# EAGLE schematic Cypher - V0.4 (EAGLE 9.0.1)
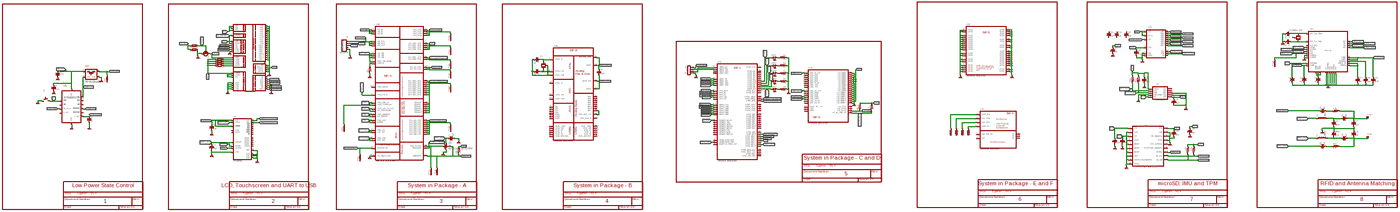
[diagram p0: schematic, sheet 1, overview]
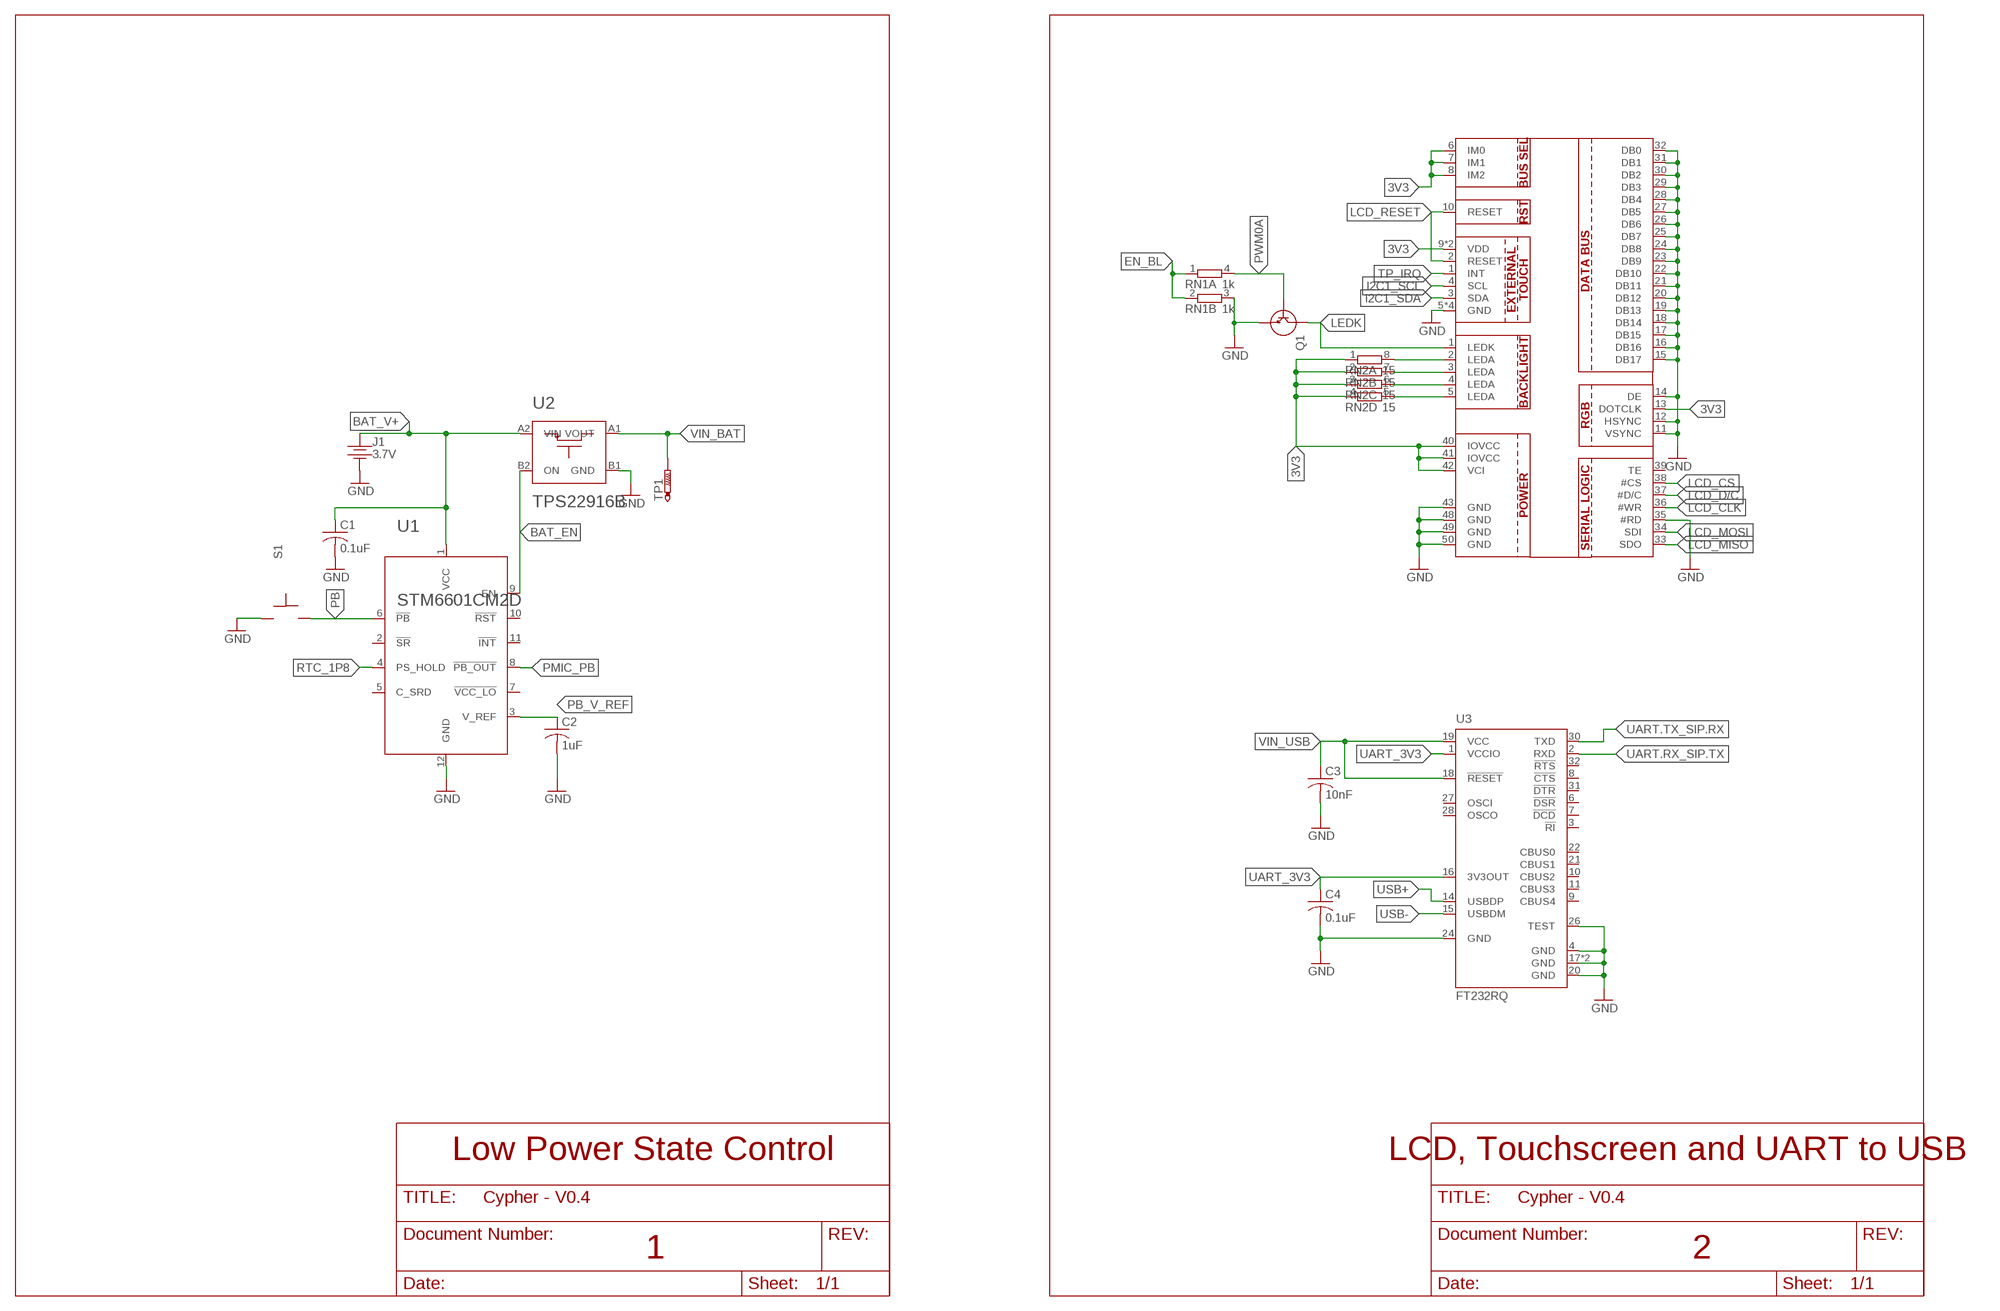
[diagram p1: schematic, sheet 1, part 1 of 5]
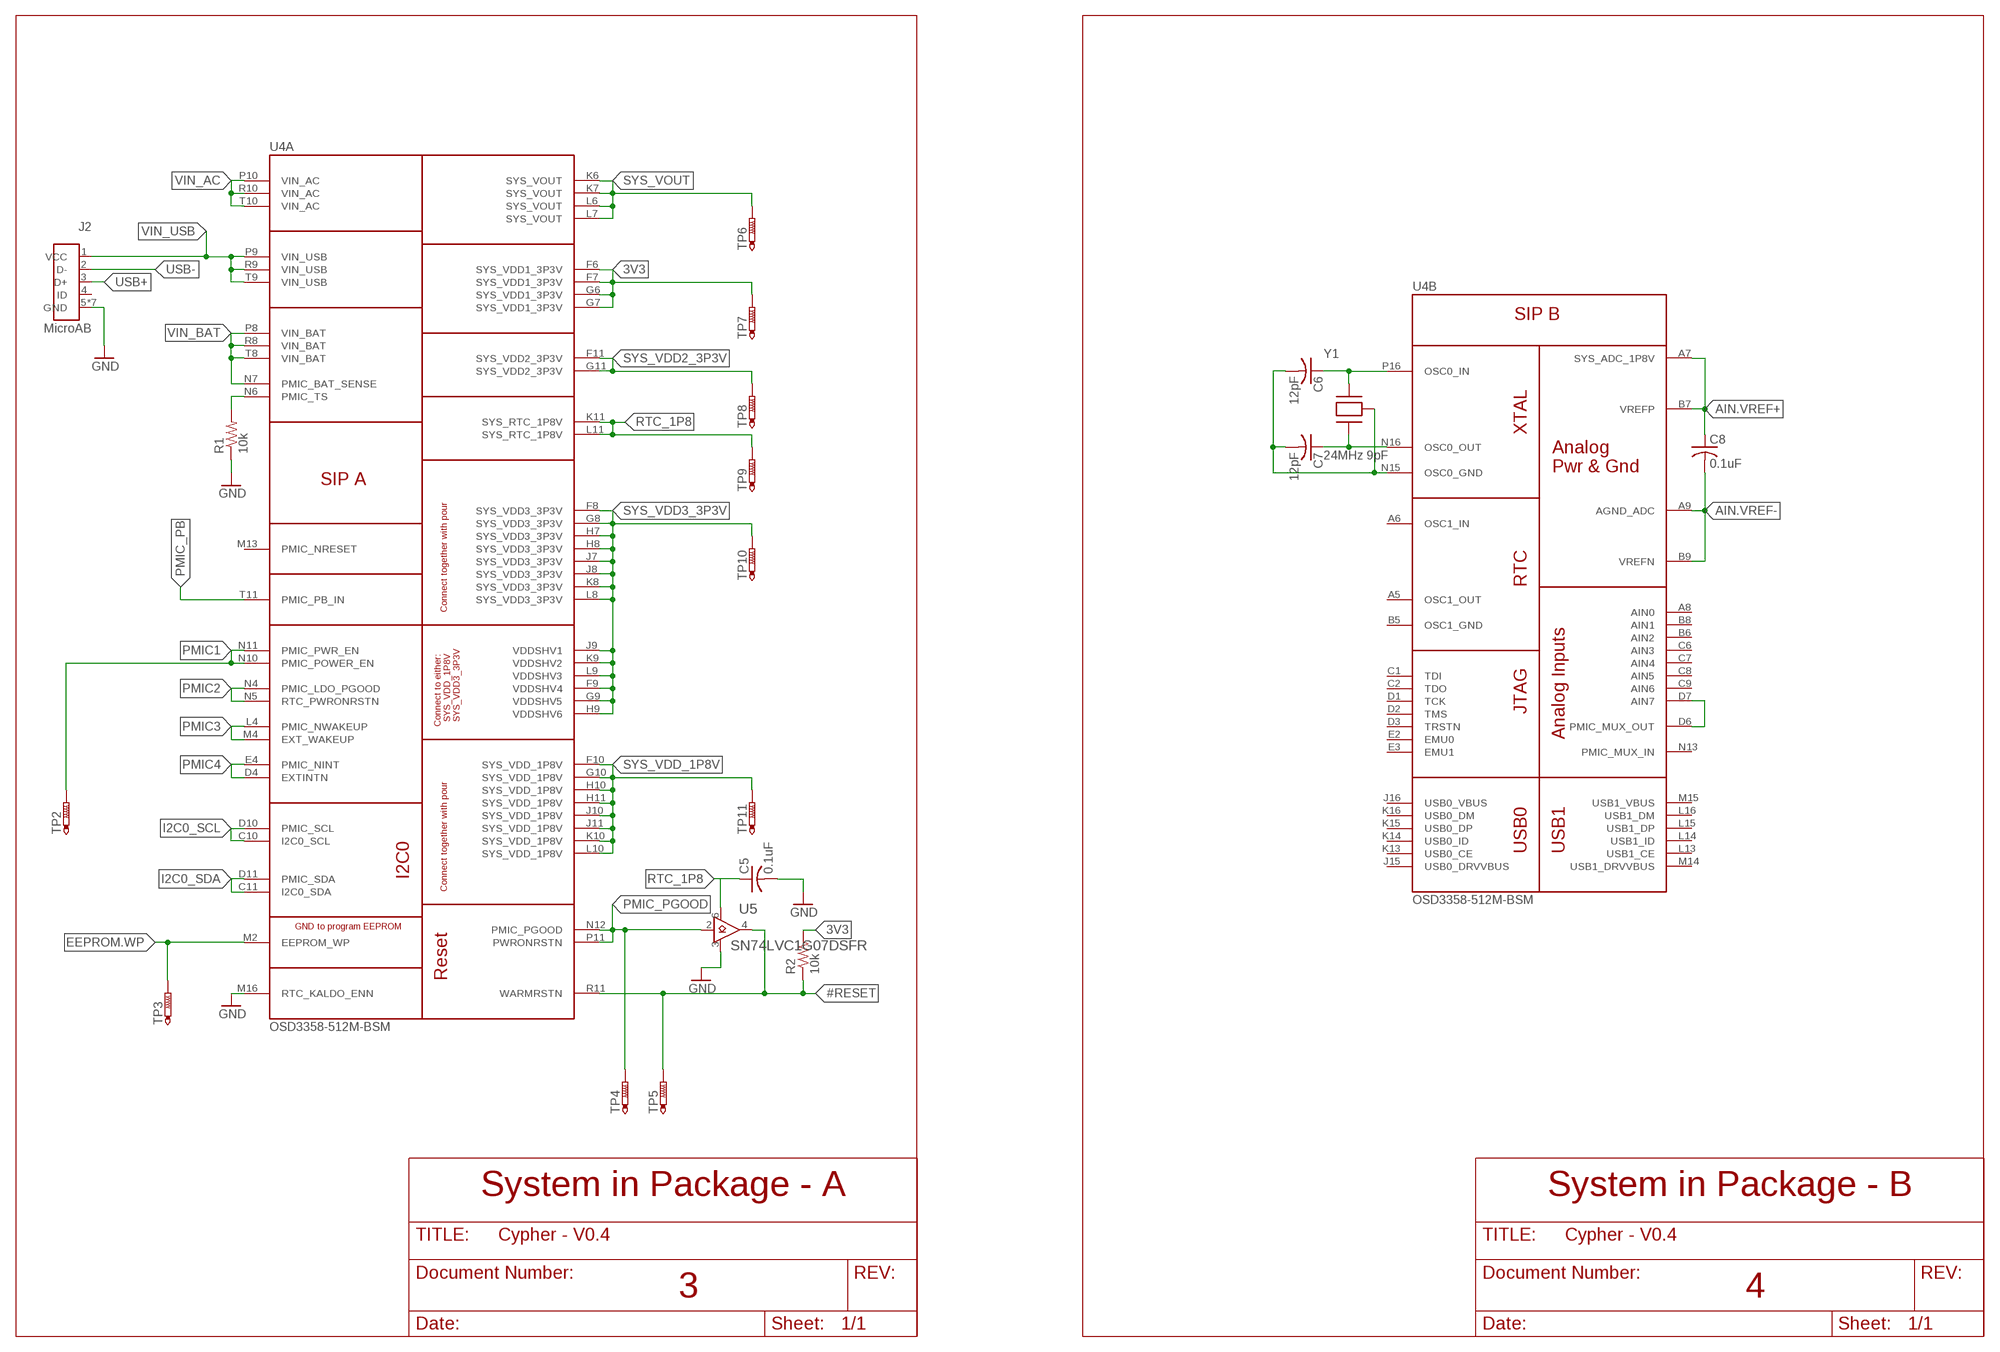
[diagram p2: schematic, sheet 1, part 2 of 5]
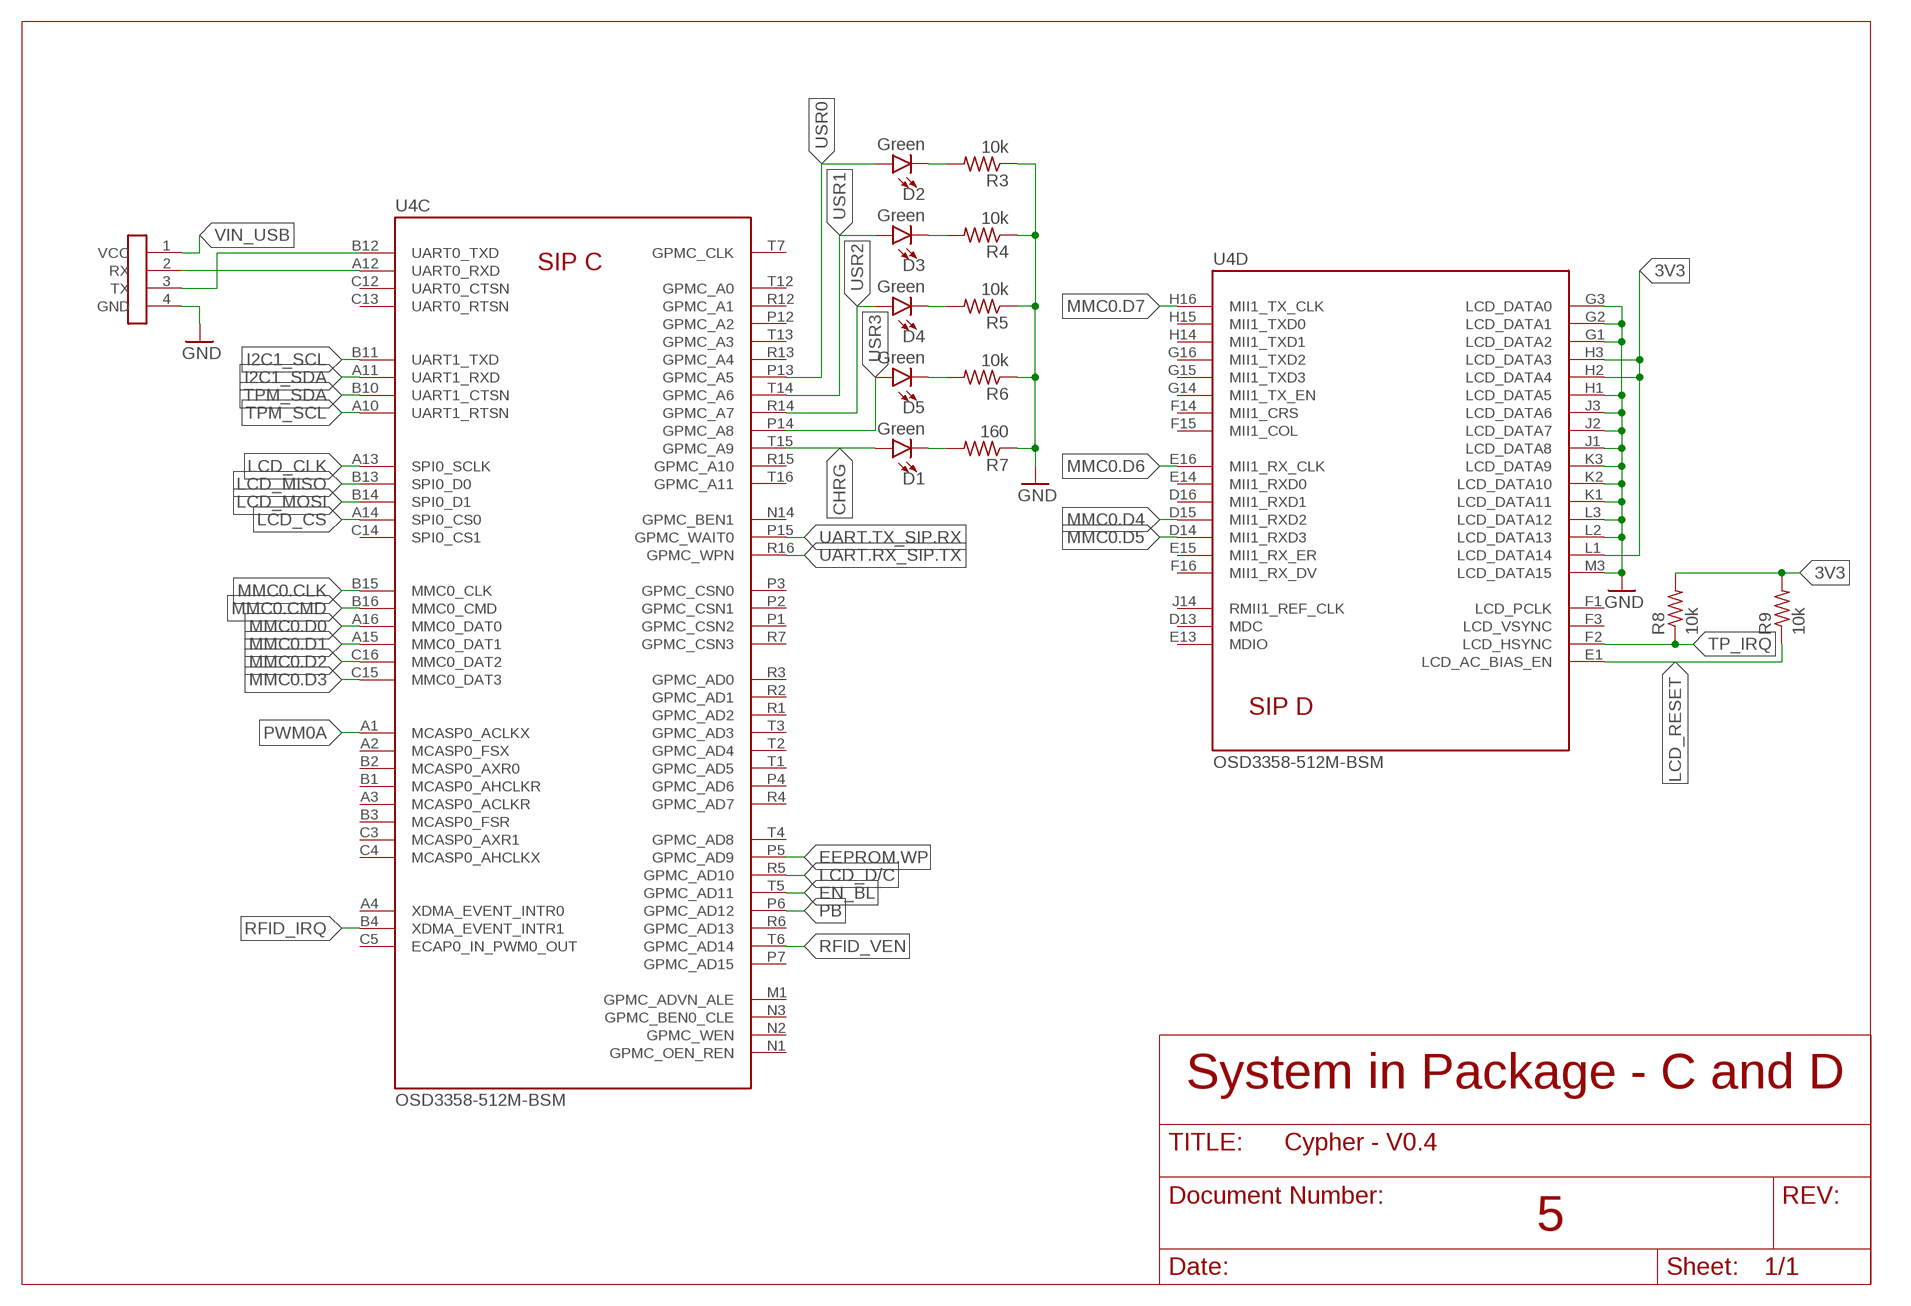
[diagram p3: schematic, sheet 1, part 3 of 5]
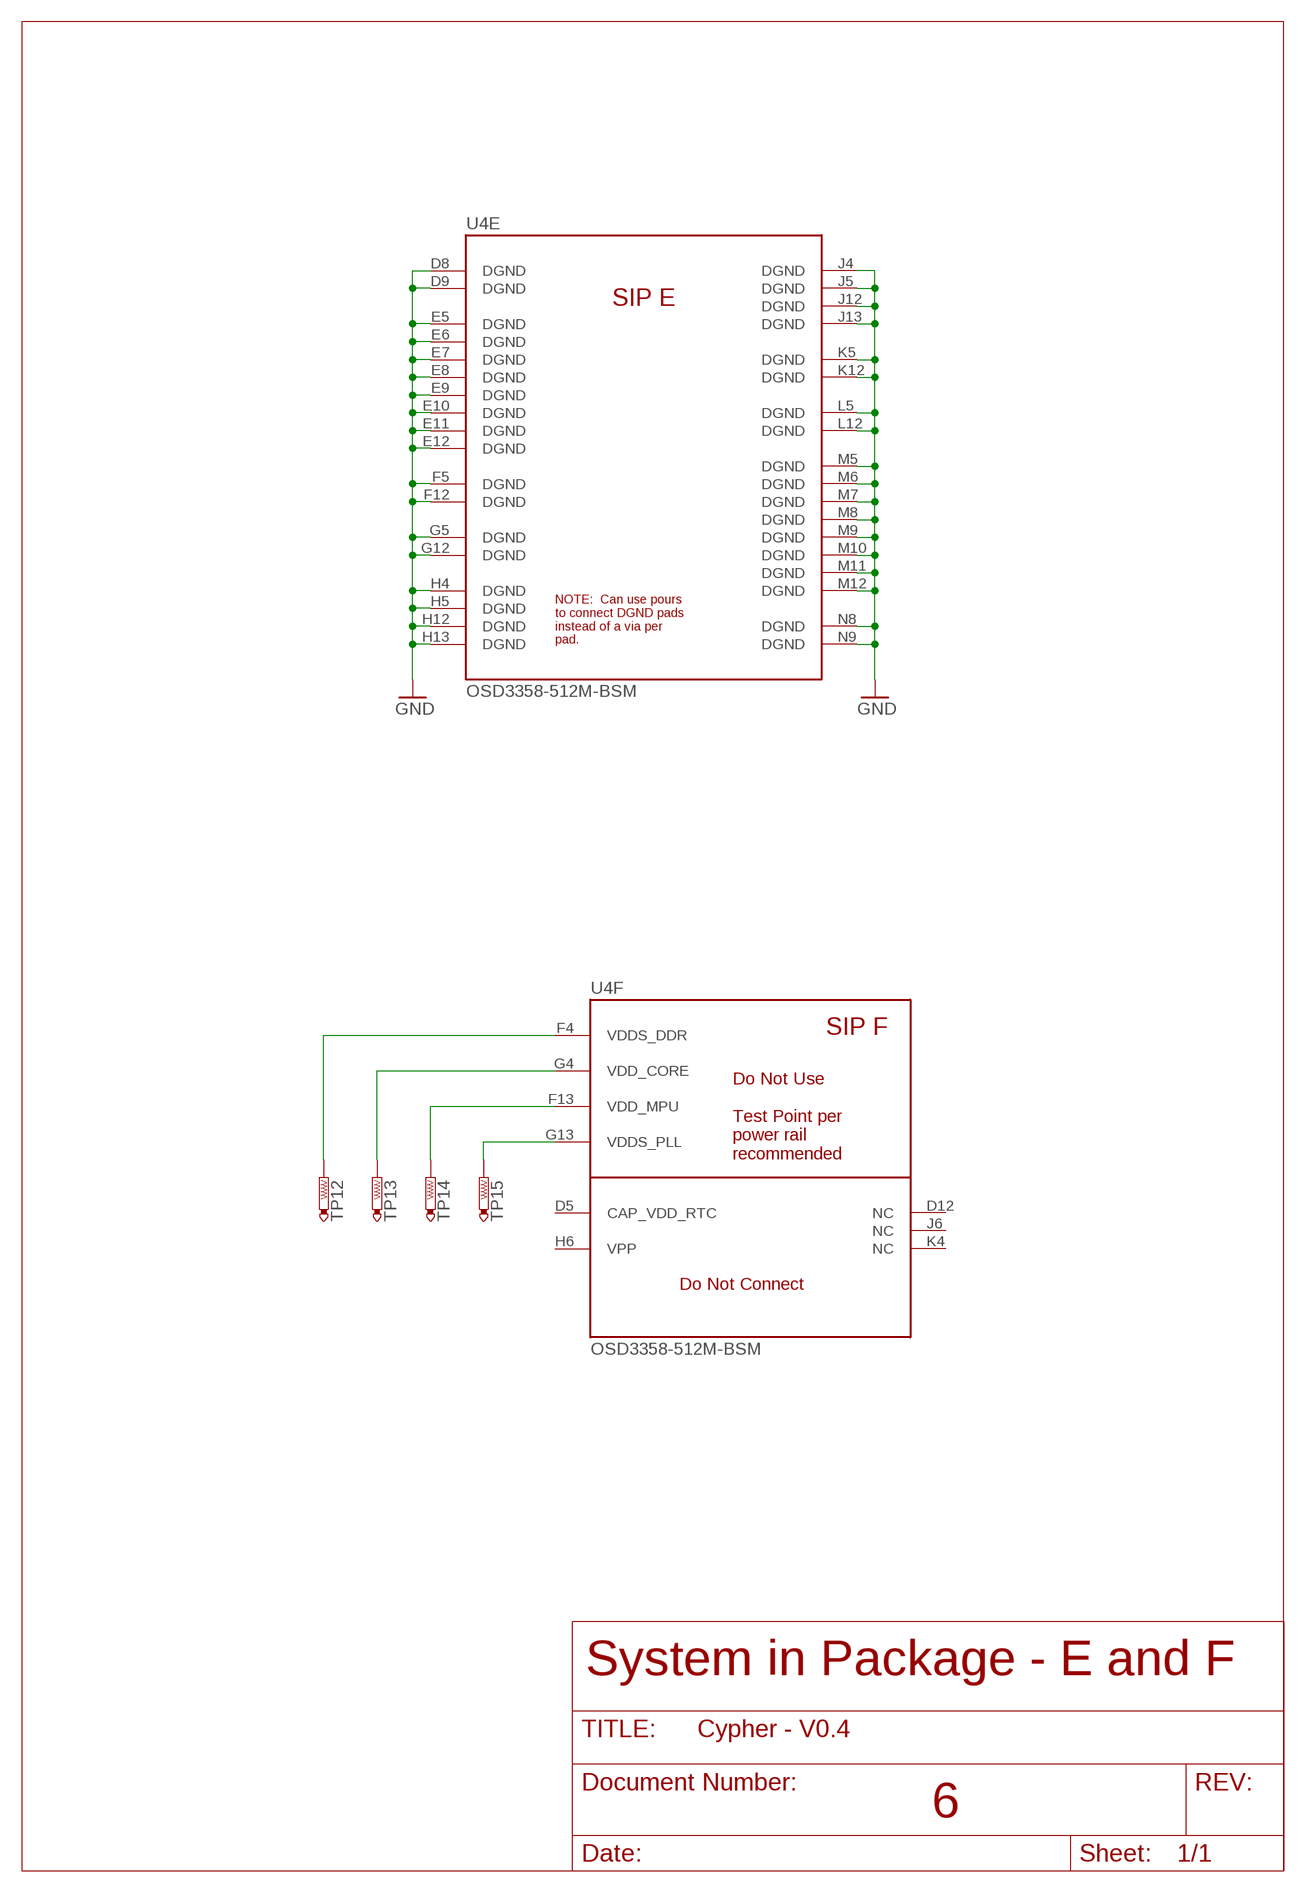
[diagram p4: schematic, sheet 1, part 4 of 5]
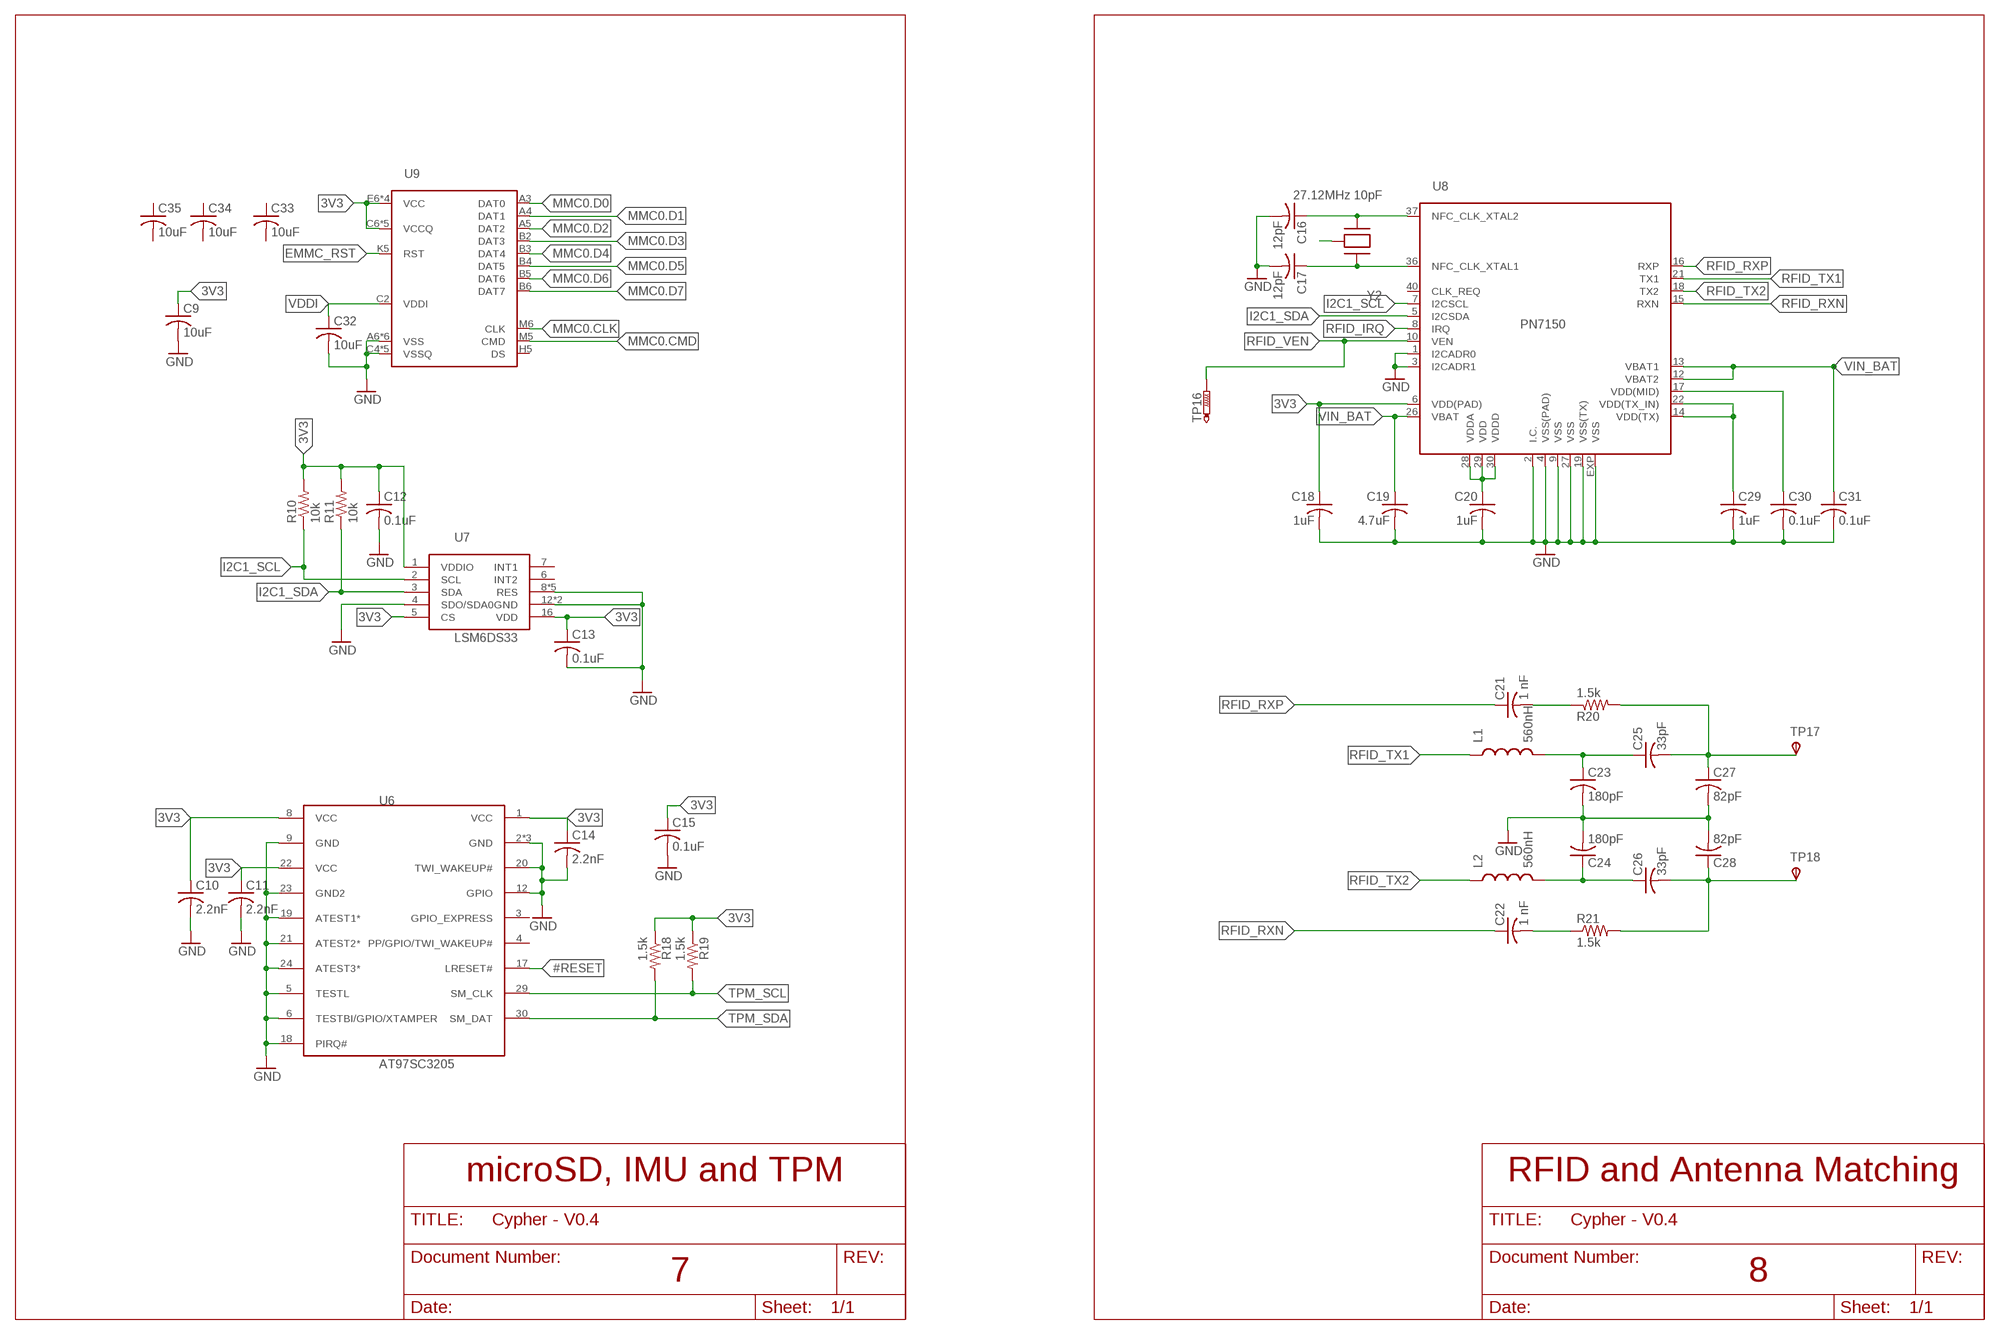
[diagram p5: schematic, sheet 1, part 5 of 5]

## Parts
C1  0.1uF  C-USC0402  [C0402]
C2  1uF  C-USC0402  [C0402]
C3  10nF  C-USC0402  [C0402]
C4  0.1uF  C-USC0402  [C0402]
C5  0.1uF  C-USC0402  [C0402]
C6  12pF  C-USC0402  [C0402]
C7  12pF  C-USC0402  [C0402]
C8  0.1uF  C-USC0402  [C0402]
C9  10uF  C-USC0402  [C0402]
C10  2.2nF  C-USC0402  [C0402]
C11  2.2nF  C-USC0402  [C0402]
C12  0.1uF  C-USC0402  [C0402]
C13  0.1uF  C-USC0402  [C0402]
C14  2.2nF  C-USC0402  [C0402]
C15  0.1uF  C-USC0402  [C0402]
C16  12pF  C-USC0402  [C0402]
C17  12pF  C-USC0402  [C0402]
C18  1uF  C-USC0402  [C0402]
C19  4.7uF  C-USC0402  [C0402]
C20  1uF  C-USC0402  [C0402]
C21  1 nF  C-USC0603  [C0603]
C22  1 nF  C-USC0603  [C0603]
C23  180pF  C-USC0402  [C0402]
C24  180pF  C-USC0402  [C0402]
C25  33pF  C-USC0402  [C0402]
C26  33pF  C-USC0402  [C0402]
C27  82pF  C-USC0402  [C0402]
C28  82pF  C-USC0402  [C0402]
C29  1uF  C-USC0402  [C0402]
C30  0.1uF  C-USC0402  [C0402]
C31  0.1uF  C-USC0402  [C0402]
C32  10uF  C-USC0402  [C0402]
C33  10uF  C-USC0402  [C0402]
C34  10uF  C-USC0402  [C0402]
C35  10uF  C-USC0402  [C0402]
D1  Green  LED0603  [LED-0603]
D2  Green  LED0603  [LED-0603]
D3  Green  LED0603  [LED-0603]
D4  Green  LED0603  [LED-0603]
D5  Green  LED0603  [LED-0603]
J1  3.7V  SH-CONNECTOR  [SH_CONNECTOR]
J2  MicroAB  MICRO_USB_AB_SMD  [MICRO-USB-AB-SMD]
J3  UARTPINSSH  [SM04B-SRSS-TB]
L1  560nH  INDUCTOR0402  [C0402]
L2  560nH  INDUCTOR0402  [C0402]
Q1  MMBT2222ASOT23  [SOT-23-3]
R1  10k  R-US_R0402  [R0402]
R2  10k  R-US_R0402  [R0402]
R3  10k  R-US_R0402  [R0402]
R4  10k  R-US_R0402  [R0402]
R5  10k  R-US_R0402  [R0402]
R6  10k  R-US_R0402  [R0402]
R7  160  R-US_R0402  [R0402]
R8  10k  R-US_R0402  [R0402]
R9  10k  R-US_R0402  [R0402]
R10  10k  R-US_R0402  [R0402]
R11  10k  R-US_R0402  [R0402]
R18  1.5k  R-US_R0402  [R0402]
R19  1.5k  R-US_R0402  [R0402]
R20  1.5k  R-US_R0402  [R0402]
R21  1.5k  R-US_R0402  [R0402]
RN1  1k  2R-NEXBV4V  [EXBV4V]
RN2  15  4R-NEXBN8V  [EXBN8V]
S1  PUSHBUTTON1.2  [EVQ-PUK]
TP1  PTR1B1,27  [B1,27]
TP2  PTR1B1,27  [B1,27]
TP3  PTR1B1,27  [B1,27]
TP4  PTR1B1,27  [B1,27]
TP5  PTR1B1,27  [B1,27]
TP6  PTR1B1,27  [B1,27]
TP7  PTR1B1,27  [B1,27]
TP8  PTR1B1,27  [B1,27]
TP9  PTR1B1,27  [B1,27]
TP10  PTR1B1,27  [B1,27]
TP11  PTR1B1,27  [B1,27]
TP12  PTR1B1,27  [B1,27]
TP13  PTR1B1,27  [B1,27]
TP14  PTR1B1,27  [B1,27]
TP15  PTR1B1,27  [B1,27]
TP16  PTR1B1,27  [B1,27]
TP17  TPSB2,54  [B2,54]
TP18  TPSB2,54  [B2,54]
U1  STM6601CM2D  STM660  [TDFN12]
U2  TPS22916B  [WSON-4PIN]
U3  FT232RQ  [QFN32]
U4  OSD3358-512M-BSM  [OSD335X-BGA-256]
U5  SN74LVC1G07DSFR  [SON35P100X100X40-6N]
U6  AT97SC3205  [QFN32-4MM]
U7  LSM6DS33  [LGA-16]
U8  PN7150  [HVQFN40]
U9  EMMC_EM-20  [153-LFBGA]
XU1  CAPTOUCHSCREEN_6PINFPC10PIN  [DF37NB-10DS-0.4V]
XU2  ILI9388_50PIN_SOCKET  [FPC/FFC_50PIN_0.5MMPITCH]
Y1  24MHz 9pF  TSX-3225  [4-SMD]
Y2  27.12MHz 10pF  CRISTAL_XRCGB  [XRCGB]

## Nets
3V3: C9.1 C10.1 C11.1 C12.1 C13.1 C14.1 C15.1 C18.1 R2.2 R8.2 R9.2 R10.2 R11.2 R18.1 R19.1 RN2.1 RN2.2 RN2.3 RN2.4 TP7.TP U4.F6(A:SYS_VDD1_3P3V) U4.F7(A:SYS_VDD1_3P3V) U4.G6(A:SYS_VDD1_3P3V) U4.G7(A:SYS_VDD1_3P3V) U4.H2(D:LCD_DATA4) U4.H3(D:LCD_DATA3) U4.L1(D:LCD_DATA14) U6.1(VCC) U6.8(VCC) U6.22(VCC) U7.1(VDDIO) U7.5(CS) U7.16(VDD) U8.6(VDD(PAD)) U9.C6(VCCQ) U9.E6(VCC) U9.F5(VCC) U9.J10(VCC) U9.K9(VCC) U9.M4(VCCQ) U9.N4(VCCQ) U9.P3(VCCQ) U9.P5(VCCQ) XU1.9(VDD) XU1.10(VDD) XU2.6(IM0) XU2.7(IM1) XU2.8(IM2) XU2.13(DOTCLK) XU2.40(IOVCC) XU2.41(IOVCC) XU2.42(VCI)
#RESET: R2.1 TP5.TP U4.R11(A:WARMRSTN) U5.4(Y) U6.17(LRESET#)
AIN.VREF+: C8.1 U4.A7(B:SYS_ADC_1P8V) U4.B7(B:VREFP)
AIN.VREF-: C8.2 U4.A9(B:AGND_ADC) U4.B9(B:VREFN)
ANT_1: C25.2 C27.1 R20.2 TP17.TP(PP)
ANT_2: C26.2 C28.1 R21.2 TP18.TP(PP)
BAT_EN: U1.9(EN) U2.B2(ON)
BAT_V+: C1.1 J1.2(V+) U1.1(VCC) U2.A2(VIN)
CHRG: D1.A U4.T15(C:GPMC_A9)
D2_CAT: D2.C R3.2
D2_CAT1: D1.C R7.2
D3_CAT: D3.C R4.2
D4_CAT: D4.C R5.2
D5_CAT: D5.C R6.2
EEPROM.WP: TP3.TP U4.M2(A:EEPROM_WP) U4.P5(C:GPMC_AD9)
EMCF_ANTM1: C23.1 C25.1 L1.2
EMCF_ANTM2: C24.1 C26.1 L2.2
EMMC_RST: U9.K5(RST)
EN_BL: RN1.1 RN1.2 U4.T5(C:GPMC_AD11)
GND: C1.2 C2.2 C3.2 C4.2 C5.2 C9.2 C10.2 C11.2 C12.2 C13.2 C14.2 C15.2 C16.2 C17.2 C18.2 C19.2 C20.2 C23.2 C24.2 C27.2 C28.2 C29.2 C30.2 C31.2 C32.2 J1.1(V-) J2.5(GND) J2.PAD1(GND) J2.PAD2(GND) J2.PAD3(GND) J2.PAD4(GND) J2.PAD5(GND) J2.PAD6(GND) J3.4(GND) Q1.E R1.1 R3.1 R4.1 R5.1 R6.1 R7.1 RN1.3 S1.2 S1.4 U1.12(GND) U2.B1(GND) U3.4(GND) U3.17(GND) U3.20(GND) U3.24(GND) U3.26(TEST) U3.EXP(GND) U4.D8(E:DGND) U4.D9(E:DGND) U4.E5(E:DGND) U4.E6(E:DGND) U4.E7(E:DGND) U4.E8(E:DGND) U4.E9(E:DGND) U4.E10(E:DGND) U4.E11(E:DGND) U4.E12(E:DGND) U4.F5(E:DGND) U4.F12(E:DGND) U4.G1(D:LCD_DATA2) U4.G2(D:LCD_DATA1) U4.G3(D:LCD_DATA0) U4.G5(E:DGND) U4.G12(E:DGND) U4.H1(D:LCD_DATA5) U4.H4(E:DGND) U4.H5(E:DGND) U4.H12(E:DGND) U4.H13(E:DGND) U4.J1(D:LCD_DATA8) U4.J2(D:LCD_DATA7) U4.J3(D:LCD_DATA6) U4.J4(E:DGND) U4.J5(E:DGND) U4.J12(E:DGND) U4.J13(E:DGND) U4.K1(D:LCD_DATA11) U4.K2(D:LCD_DATA10) U4.K3(D:LCD_DATA9) U4.K5(E:DGND) U4.K12(E:DGND) U4.L2(D:LCD_DATA13) U4.L3(D:LCD_DATA12) U4.L5(E:DGND) U4.L12(E:DGND) U4.M3(D:LCD_DATA15) U4.M5(E:DGND) U4.M6(E:DGND) U4.M7(E:DGND) U4.M8(E:DGND) U4.M9(E:DGND) U4.M10(E:DGND) U4.M11(E:DGND) U4.M12(E:DGND) U4.M16(A:RTC_KALDO_ENN) U4.N8(E:DGND) U4.N9(E:DGND) U5.3(GND) U6.2(GND) U6.5(TESTL) U6.6(TESTBI/GPIO/XTAMPER) U6.9(GND) U6.12(GPIO) U6.18(PIRQ#) U6.19(ATEST1*) U6.20(TWI_WAKEUP#) U6.21(ATEST2*) U6.23(GND2) U6.24(ATEST3*) U6.32(GND) U6.EXP(GND) U7.4(SDO/SDA0) U7.8(RES) U7.9(RES) U7.10(RES) U7.11(RES) U7.12(GND) U7.13(GND) U7.15(RES) U8.1(I2CADR0) U8.2(I.C.) U8.3(I2CADR1) U8.4(VSS(PAD)) U8.9(VSS) U8.19(VSS(TX)) U8.27(VSS) U8.EXP(VSS) U9.A6(VSS) U9.C4(VSSQ) U9.E7(VSS) U9.G5(VSS) U9.H10(VSS) U9.J5(VSS) U9.K8(VSS) U9.N2(VSSQ) U9.N5(VSSQ) U9.P4(VSSQ) U9.P6(VSSQ) XU1.5(GND) XU1.6(GND) XU1.7(GND) XU1.8(GND) XU2.11(VSYNC) XU2.12(HSYNC) XU2.14(DE) XU2.15(DB17) XU2.16(DB16) XU2.17(DB15) XU2.18(DB14) XU2.19(DB13) XU2.20(DB12) XU2.21(DB11) XU2.22(DB10) XU2.23(DB9) XU2.24(DB8) XU2.25(DB7) XU2.26(DB6) XU2.27(DB5) XU2.28(DB4) XU2.29(DB3) XU2.30(DB2) XU2.31(DB1) XU2.32(DB0) XU2.35(#RD) XU2.43(GND) XU2.48(GND) XU2.49(GND) XU2.50(GND)
I2C0_SCL: U4.C10(A:I2C0_SCL) U4.D10(A:PMIC_SCL)
I2C0_SDA: U4.C11(A:I2C0_SDA) U4.D11(A:PMIC_SDA)
I2C1_SCL: R10.1 U4.B11(C:UART1_TXD) U7.2(SCL) U8.7(I2CSCL) XU1.4(SCL)
I2C1_SDA: R11.1 U4.A11(C:UART1_RXD) U7.3(SDA) U8.5(I2CSDA) XU1.3(SDA)
LCD_CLK: U4.A13(C:SPI0_SCLK) XU2.36(#WR)
LCD_CS: U4.A14(C:SPI0_CS0) XU2.38(#CS)
LCD_D/C: U4.R5(C:GPMC_AD10) XU2.37(#D/C)
LCD_MISO: U4.B13(C:SPI0_D0) XU2.33(SDO)
LCD_MOSI: U4.B14(C:SPI0_D1) XU2.34(SDI)
LCD_RESET: R9.1 U4.E1(D:LCD_AC_BIAS_EN) XU1.2(RESET) XU2.10(RESET)
LEDA@2: RN2.8 XU2.2(LEDA)
LEDA@3: RN2.7 XU2.3(LEDA)
LEDA@4: RN2.6 XU2.4(LEDA)
LEDA@5: RN2.5 XU2.5(LEDA)
LEDK: Q1.C XU2.1(LEDK)
MMC0.CLK: U4.B15(C:MMC0_CLK) U9.M6(CLK)
MMC0.CMD: U4.B16(C:MMC0_CMD) U9.M5(CMD)
MMC0.D0: U4.A16(C:MMC0_DAT0) U9.A3(DAT0)
MMC0.D1: U4.A15(C:MMC0_DAT1) U9.A4(DAT1)
MMC0.D2: U4.C16(C:MMC0_DAT2) U9.A5(DAT2)
MMC0.D3: U4.C15(C:MMC0_DAT3) U9.B2(DAT3)
MMC0.D4: U4.D15(D:MII1_RXD2) U9.B3(DAT4)
MMC0.D5: U4.D14(D:MII1_RXD3) U9.B4(DAT5)
MMC0.D6: U4.E16(D:MII1_RX_CLK) U9.B5(DAT6)
MMC0.D7: U4.H16(D:MII1_TX_CLK) U9.B6(DAT7)
NC: Y2.2(GND) Y2.4(GND)
OSC_GND: C6.2 C7.2 U4.N15(B:OSC0_GND) Y1.2(GND) Y1.4(GND)
PB: S1.1 S1.3 U1.6(!PB) U4.P6(C:GPMC_AD12)
PB_V_REF: C2.1 U1.3(V_REF)
PMIC1: TP2.TP U4.N10(A:PMIC_POWER_EN) U4.N11(A:PMIC_PWR_EN)
PMIC2: U4.N4(A:PMIC_LDO_PGOOD) U4.N5(A:RTC_PWRONRSTN)
PMIC3: U4.L4(A:PMIC_NWAKEUP) U4.M4(A:EXT_WAKEUP)
PMIC4: U4.D4(A:EXTINTN) U4.E4(A:PMIC_NINT)
PMIC_MUX: U4.D6(B:PMIC_MUX_OUT) U4.D7(B:AIN7)
PMIC_PB: U1.8(!PB_OUT) U4.T11(A:PMIC_PB_IN)
PMIC_PGOOD: TP4.TP U4.N12(A:PMIC_PGOOD) U4.P11(A:PWRONRSTN) U5.2(A)
PMIC_TS: R1.2 U4.N6(A:PMIC_TS)
PWM0A: Q1.B RN1.4 U4.A1(C:MCASP0_ACLKX)
RFID_IRQ: U4.B4(C:XDMA_EVENT_INTR1) U8.8(IRQ)
RFID_MISC_1: C21.2 R20.1
RFID_MISC_2: C22.2 R21.1
RFID_OSC_IN: C17.1 U8.36(NFC_CLK_XTAL1) Y2.1(OSC_IN)
RFID_OSC_OUT: C16.1 U8.37(NFC_CLK_XTAL2) Y2.3(OSC_OUT)
RFID_RXN: C22.1 U8.15(RXN)
RFID_RXP: C21.1 U8.16(RXP)
RFID_TX1: L1.1 U8.21(TX1)
RFID_TX2: L2.1 U8.18(TX2)
RFID_VEN: TP16.TP U4.T6(C:GPMC_AD14) U8.10(VEN)
RTC_1P8: C5.1 TP9.TP U1.4(PS_HOLD) U4.K11(A:SYS_RTC_1P8V) U4.L11(A:SYS_RTC_1P8V) U5.6(VCC)
SIP_OSC_IN: C6.1 U4.P16(B:OSC0_IN) Y1.1(OSC_IN)
SIP_OSC_OUT: C7.1 U4.N16(B:OSC0_OUT) Y1.3(OSC_OUT)
SYS_VDD2_3P3V: TP8.TP U4.F11(A:SYS_VDD2_3P3V) U4.G11(A:SYS_VDD2_3P3V)
SYS_VDD3_3P3V: TP10.TP U4.F8(A:SYS_VDD3_3P3V) U4.F9(A:VDDSHV4) U4.G8(A:SYS_VDD3_3P3V) U4.G9(A:VDDSHV5) U4.H7(A:SYS_VDD3_3P3V) U4.H8(A:SYS_VDD3_3P3V) U4.H9(A:VDDSHV6) U4.J7(A:SYS_VDD3_3P3V) U4.J8(A:SYS_VDD3_3P3V) U4.J9(A:VDDSHV1) U4.K8(A:SYS_VDD3_3P3V) U4.K9(A:VDDSHV2) U4.L8(A:SYS_VDD3_3P3V) U4.L9(A:VDDSHV3)
SYS_VDD_1P8V: TP11.TP U4.F10(A:SYS_VDD_1P8V) U4.G10(A:SYS_VDD_1P8V) U4.H10(A:SYS_VDD_1P8V) U4.H11(A:SYS_VDD_1P8V) U4.J10(A:SYS_VDD_1P8V) U4.J11(A:SYS_VDD_1P8V) U4.K10(A:SYS_VDD_1P8V) U4.L10(A:SYS_VDD_1P8V)
SYS_VOUT: TP6.TP U4.K6(A:SYS_VOUT) U4.K7(A:SYS_VOUT) U4.L6(A:SYS_VOUT) U4.L7(A:SYS_VOUT)
TP_IRQ: R8.1 U4.F2(D:LCD_HSYNC) XU1.1(INT)
TPM_SCL: R19.2 U4.A10(C:UART1_RTSN) U6.29(SM_CLK)
TPM_SDA: R18.2 U4.B10(C:UART1_CTSN) U6.30(SM_DAT)
UART0_RX: J3.2(RX) U4.A12(C:UART0_RXD)
UART0_TX: J3.3(TX) U4.B12(C:UART0_TXD)
UART.RX_SIP.TX: U3.2(RXD) U4.R16(C:GPMC_WPN)
UART.TX_SIP.RX: U3.30(TXD) U4.P15(C:GPMC_WAIT0)
UART_3V3: C4.1 U3.1(VCCIO) U3.16(3V3OUT)
USB+: J2.3(D+) U3.14(USBDP)
USB-: J2.2(D-) U3.15(USBDM)
USR0: D2.A U4.P13(C:GPMC_A5)
USR1: D3.A U4.T14(C:GPMC_A6)
USR2: D4.A U4.R14(C:GPMC_A7)
USR3: D5.A U4.P14(C:GPMC_A8)
VDD: C20.1 U8.28(VDDA) U8.29(VDD) U8.30(VDDD)
VDD(MID): C30.1 U8.17(VDD(MID))
VDD(TX): C29.1 U8.14(VDD(TX)) U8.22(VDD(TX_IN))
VDD_CORE: TP13.TP U4.G4(F:VDD_CORE)
VDD_MPU: TP14.TP U4.F13(F:VDD_MPU)
VDDI: C32.1 U9.C2(VDDI)
VDDS_DDR: TP12.TP U4.F4(F:VDDS_DDR)
VDDS_PLL: TP15.TP U4.G13(F:VDDS_PLL)
VIN_AC: U4.P10(A:VIN_AC) U4.R10(A:VIN_AC) U4.T10(A:VIN_AC)
VIN_BAT: C19.1 C31.1 TP1.TP U2.A1(VOUT) U4.N7(A:PMIC_BAT_SENSE) U4.P8(A:VIN_BAT) U4.R8(A:VIN_BAT) U4.T8(A:VIN_BAT) U8.12(VBAT2) U8.13(VBAT1) U8.26(VBAT)
VIN_USB: C3.1 J2.1(VCC) J3.1(VCC) U3.18(!RESET) U3.19(VCC) U4.P9(A:VIN_USB) U4.R9(A:VIN_USB) U4.T9(A:VIN_USB)
Unconnected: C33.1 C33.2 C34.1 C34.2 C35.1 C35.2 J2.4(ID) U1.2(!SR) U1.5(C_SRD) U1.7(!VCC_LO) U1.10(!RST) U1.11(!INT) U3.3(!RI) U3.6(!DSR) U3.7(!DCD) U3.8(!CTS) U3.9(CBUS4) U3.10(CBUS2) U3.11(CBUS3) U3.21(CBUS1) U3.22(CBUS0) U3.27(OSCI) U3.28(OSCO) U3.31(!DTR) U3.32(!RTS) U4.A2(C:MCASP0_FSX) U4.A3(C:MCASP0_ACLKR) U4.A4(C:XDMA_EVENT_INTR0) U4.A5(B:OSC1_OUT) U4.A6(B:OSC1_IN) U4.A8(B:AIN0) U4.B1(C:MCASP0_AHCLKR) U4.B2(C:MCASP0_AXR0) U4.B3(C:MCASP0_FSR) U4.B5(B:OSC1_GND) U4.B6(B:AIN2) U4.B8(B:AIN1) U4.C1(B:TDI) U4.C2(B:TDO) U4.C3(C:MCASP0_AXR1) U4.C4(C:MCASP0_AHCLKX) U4.C5(C:ECAP0_IN_PWM0_OUT) U4.C6(B:AIN3) U4.C7(B:AIN4) U4.C8(B:AIN5) U4.C9(B:AIN6) U4.C12(C:UART0_CTSN) U4.C13(C:UART0_RTSN) U4.C14(C:SPI0_CS1) U4.D1(B:TCK) U4.D2(B:TMS) U4.D3(B:TRSTN) U4.D5(F:CAP_VDD_RTC) U4.D12(F:NC) U4.D13(D:MDC) U4.D16(D:MII1_RXD1) U4.E2(B:EMU0) U4.E3(B:EMU1) U4.E13(D:MDIO) U4.E14(D:MII1_RXD0) U4.E15(D:MII1_RX_ER) U4.F1(D:LCD_PCLK) U4.F3(D:LCD_VSYNC) U4.F14(D:MII1_CRS) U4.F15(D:MII1_COL) U4.F16(D:MII1_RX_DV) U4.G14(D:MII1_TX_EN) U4.G15(D:MII1_TXD3) U4.G16(D:MII1_TXD2) U4.H6(F:VPP) U4.H14(D:MII1_TXD1) U4.H15(D:MII1_TXD0) U4.J6(F:NC) U4.J14(D:RMII1_REF_CLK) U4.J15(B:USB0_DRVVBUS) U4.J16(B:USB0_VBUS) U4.K4(F:NC) U4.K13(B:USB0_CE) U4.K14(B:USB0_ID) U4.K15(B:USB0_DP) U4.K16(B:USB0_DM) U4.L13(B:USB1_CE) U4.L14(B:USB1_ID) U4.L15(B:USB1_DP) U4.L16(B:USB1_DM) U4.M1(C:GPMC_ADVN_ALE) U4.M13(A:PMIC_NRESET) U4.M14(B:USB1_DRVVBUS) U4.M15(B:USB1_VBUS) U4.N1(C:GPMC_OEN_REN) U4.N2(C:GPMC_WEN) U4.N3(C:GPMC_BEN0_CLE) U4.N13(B:PMIC_MUX_IN) U4.N14(C:GPMC_BEN1) U4.P1(C:GPMC_CSN2) U4.P2(C:GPMC_CSN1) U4.P3(C:GPMC_CSN0) U4.P4(C:GPMC_AD6) U4.P7(C:GPMC_AD15) U4.P12(C:GPMC_A2) U4.R1(C:GPMC_AD2) U4.R2(C:GPMC_AD1) U4.R3(C:GPMC_AD0) U4.R4(C:GPMC_AD7) U4.R6(C:GPMC_AD13) U4.R7(C:GPMC_CSN3) U4.R12(C:GPMC_A1) U4.R13(C:GPMC_A4) U4.R15(C:GPMC_A10) U4.T1(C:GPMC_AD5) U4.T2(C:GPMC_AD4) U4.T3(C:GPMC_AD3) U4.T4(C:GPMC_AD8) U4.T7(C:GPMC_CLK) U4.T12(C:GPMC_A0) U4.T13(C:GPMC_A3) U4.T16(C:GPMC_A11) U5.1(N.C_2) U5.5(N.C) U6.3(GPIO_EXPRESS) U6.4(PP/GPIO/TWI_WAKEUP#) U7.6(INT2) U7.7(INT1) U8.40(CLK_REQ) U9.H5(DS) XU2.39(TE)

## Notes on the sheet
- System in Package - C and D
- 5
- System in Package - E and F | microSD, IMU and TPM | RFID and Antenna Matching
- Low Power State Control | LCD, Touchscreen and UART to USB | System in Package - A | System in Package - B
- 6 | 7 | 8
- 1 | 2 | 3 | 4

## Library data of the parts
C1-C35 = resistor:C-US: CAPACITOR, American symbol
D1-D5 = SparkFun-LED:LED: LED (Generic) Standard schematic elements and footprints for 5mm, 3mm, 1206, and 0603 sized LEDs. Generic LEDs with no color specified.
J1 = Megahash:SH-CONNECTOR
J2 = Megahash:MICRO_USB_AB_SMD
J3 = Megahash:UARTPINS
L1 L2 = TPM:INDUCTOR: Inductors Basic Inductor/Choke - 0603 and 1206. Footprints are not proven and vary greatly between part numbers. INDUCTOR POWER 3.3UH 4.0A SMD 0.197" L x 0.197" W x 0.177" H (5.00mm x 5.00mm x 4.50mm)
Q1 = Megahash:MMBT2222A
R1-R11 R18-R21 = resistor:R-US_: RESISTOR, American symbol
RN1 = resistor-dil:2R-N: Array Chip Resistor Source: Panasonic; OC_FARNELL: unknown; OC_NEWARK: unknown
RN2 = resistor-dil:4R-N: Array Chip Resistor Source: RS Component / Phycomp; OC_FARNELL: unknown; OC_NEWARK: unknown
S1 = Megahash:PUSHBUTTON
TP1-TP16 = testpad:PTR1: TEST PIN
TP17 TP18 = testpad:TPS: TEST PIN
U1 = Megahash:STM660
U2 = Megahash:TPS22916B
U3 = ftdichip:FT232R: Source: http://www.ftdichip.com/Documents/DataSheets/DS_FT232R_v104.pdf; MPN: FT232RQ-REEL; OC_FARNELL: 1146033; OC_NEWARK: 91K9919
U4 = Octavo-Systems:OSD3358-512M-BSM: Octavo Systems LLC OSD335x Family SiP: 21mm x 21mm, 1.27mm pitch 256 pin BGA contains AM3358, 512MB DDR3, TPS65217, TL5209, EEPROM and passives. Commerical Temperature: 0C to 85C.; MPN: BB-POCKET; OC_NEWARK: 45AC6372
U5 = Texas Instruments_By_element14_Batch_1:SN74LVC1G07DSFR: SINGLE BUFFER/DRIVER; MPN: SN74LVC1G07DSFR; OC_FARNELL: 2057110; OC_NEWARK: 64T4114; PACKAGE: SON-6; SUPPLIER: TEXAS INSTRUMENTS
U6 = Megahash:AT97SC3205: AT97SC3205 Atmel Trusted Platform Module – I2C Interface The Atmel AT97SC3205 is a fully integrated security module designed to be integrated into personal computers and other embedded systems. It implements version 1.2 of the Trusted Computing Group (TCG) specification for Trusted Platform Modules (TPM). Package: 32 pin QFN Online info: Datasheet <http://ww1.microchip.com/downloads/en/DeviceDoc/Atmel-8883S-TPM-AT97SC3205T-Datasheet-Summary.pdf> and Digikey page <https://www.digikey.com/product-detail/en/microchip-technology/AT97SC3205T-G3M4C-10/AT97SC3205T-G3M4C-10CT-ND/7796837>.
U7 = Megahash:LSM6DS33; MPN: LSM6DS33TR; OC_NEWARK: 18AC7419
U8 = Megahash:PN7150
U9 = Megahash:EMMC_EM-20
XU1 = Megahash:CAPTOUCHSCREEN_6PINFPC
XU2 = Megahash:ILI9388_50PIN_SOCKET
Y1 = Megahash:TSX-3225
Y2 = Megahash:CRISTAL_XRCGB